# Altium schematic sheet Плата CCD Э3.SchDoc
size 219 x 307 mm; Address1: 1; SheetTotal: 1; TypeD: Схема электрическая принципиальная; Name: Плата CCD
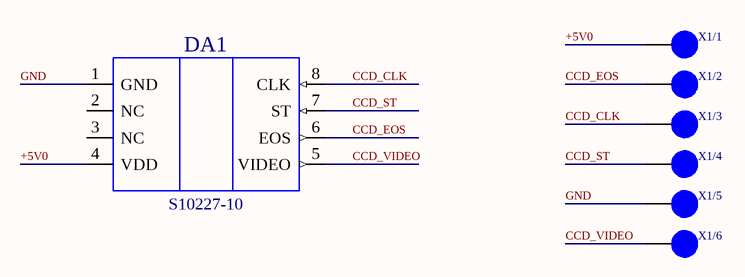
[diagram p0: Плата CCD Э3.SchDoc]

## Parts
DA1  S10227-10  [S10227-10]
X1/1  SolderPint  [PCB_PAD]  (value not drawn)
X1/2  SolderPint  [PCB_PAD]  (value not drawn)
X1/3  SolderPint  [PCB_PAD]  (value not drawn)
X1/4  SolderPint  [PCB_PAD]  (value not drawn)
X1/5  SolderPint  [PCB_PAD]  (value not drawn)
X1/6  SolderPint  [PCB_PAD]  (value not drawn)

## Nets
+5V0: DA1.4(VDD) X1/1.1
CCD_CLK: DA1.8(CLK) X1/3.1
CCD_EOS: DA1.6(EOS) X1/2.1
CCD_ST: DA1.7(ST) X1/4.1
CCD_VIDEO: DA1.5(VIDEO) X1/6.1
GND: DA1.1(GND) X1/5.1

Not connected (* = marked no-connect by the designer): DA1 2(NC) 3(NC)

## Notes on the sheet
- Перв. примен.
- Справ.№
- A
- Подп. и дата.
- Инв. № дубл.
- Взам. инв. №.
- Лит.
- Масса
- Масштаб
- Разраб.
- Провер.
- Изм
- Лист
- № докум.
- Подп.
- Дата
- Инв. № подл.
- Нач.сект.
- Т.контр.
- Листов
- Копировал
- Утв.
- Н.контр.
- Формат А4

## Library data of the parts
DA1 = S10227-10: Микросхема S10227-10; ValueBOM: Микросхема S10227-10 Hamamatsu; ГОСТ: Hamamatsu; КЛАСС: Микросхема; ValueSch: S10227-10; Package: SMD; Part Number: S10227-10; Imbase Key: *
X1/1-X1/6 = SolderPoint